# Altium schematic sheet TP_IHM_7SEG_DRIVERS.SchDoc
size A4
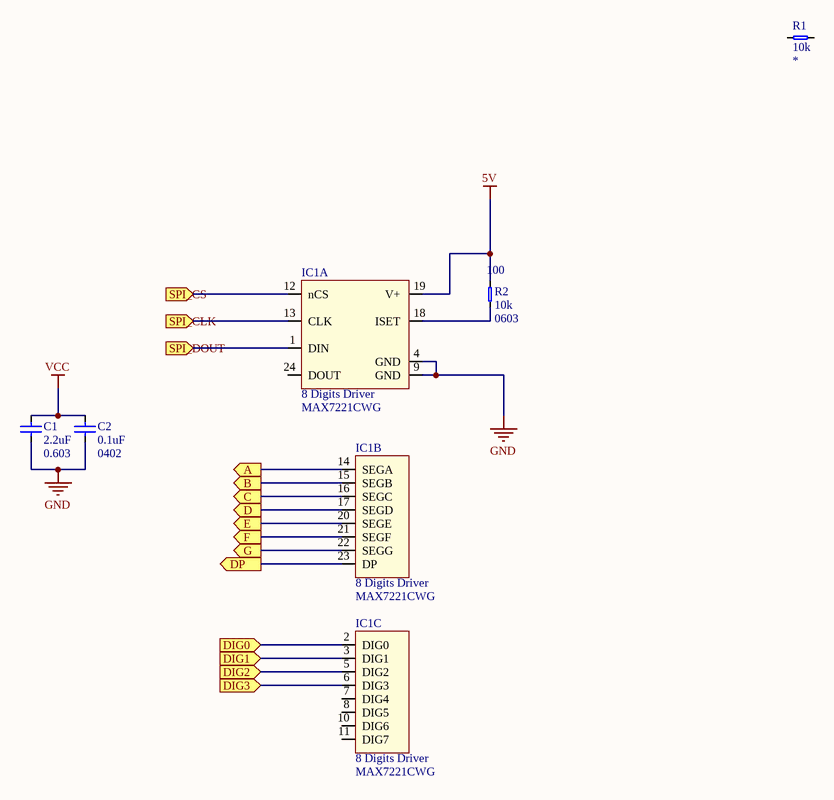
[diagram p0: TP_IHM_7SEG_DRIVERS.SchDoc]

## Parts
C1  value 2.2uF  Package: 0.603  [0603_CAP_LD]  (hidden comment: CerCap)
C2  value 0.1uF  Package: 0402  [0603_CAP_LD]  (hidden comment: CerCap)
IC1  8 Digits Driver  [MAX7221CWG]  (parts A,B,C of 3)
R1  value 10k  [0603_RES_LD]  (hidden comment: Resistor)
R2  value 10k  Precision: 100  Package: 0603  [0603_RES_LD]  (hidden comment: Resistor)

## Ports
A (out), B (out), C (out), D (out), DIG0 (in), DIG1 (in), DIG2 (in), DIG3 (in), DP (out), E (out), F (out), G (out), SPI_CLK (in), SPI_CS (in), SPI_DOUT (in)

## Nets
5V: IC1.19(V+) R2.2
GND: C1.1 C2.1 IC1.4(GND) IC1.9(GND)
VCC: C1.2 C2.2
A: IC1.14(SEGA) ; port A
B: IC1.15(SEGB) ; port B
C: IC1.16(SEGC) ; port C
D: IC1.17(SEGD) ; port D
DIG0: IC1.2(DIG0) ; port DIG0
DIG1: IC1.3(DIG1) ; port DIG1
DIG2: IC1.5(DIG2) ; port DIG2
DIG3: IC1.6(DIG3) ; port DIG3
DP: IC1.23(DP) ; port DP
E: IC1.20(SEGE) ; port E
F: IC1.21(SEGF) ; port F
G: IC1.22(SEGG) ; port G
SPI_CLK: IC1.13(CLK) ; port SPI_CLK
SPI_CS: IC1.12(nCS) ; port SPI_CS
SPI_DOUT: IC1.1(DIN) ; port SPI_DOUT
NetIC1_18: IC1.18(ISET) R2.1

Not connected (* = marked no-connect by the designer): IC1 7(DIG4) 8(DIG5) 10(DIG6) 11(DIG7) 24(DOUT); R1 1 2

## Library data of the parts
C1 C2 = CerCap: Ceramic Capacitor; Type: *; Voltage/Power: *
IC1 = MAX7221: MAX7221 8 Digit 7 Segments Display; Reference: MAX7221CWG
R1 R2 = Resistor
  R1: Precision: *; Package: *